# Altium schematic sheet Power.SchDoc
size A3; SheetNumber: 2; SheetTotal: 4
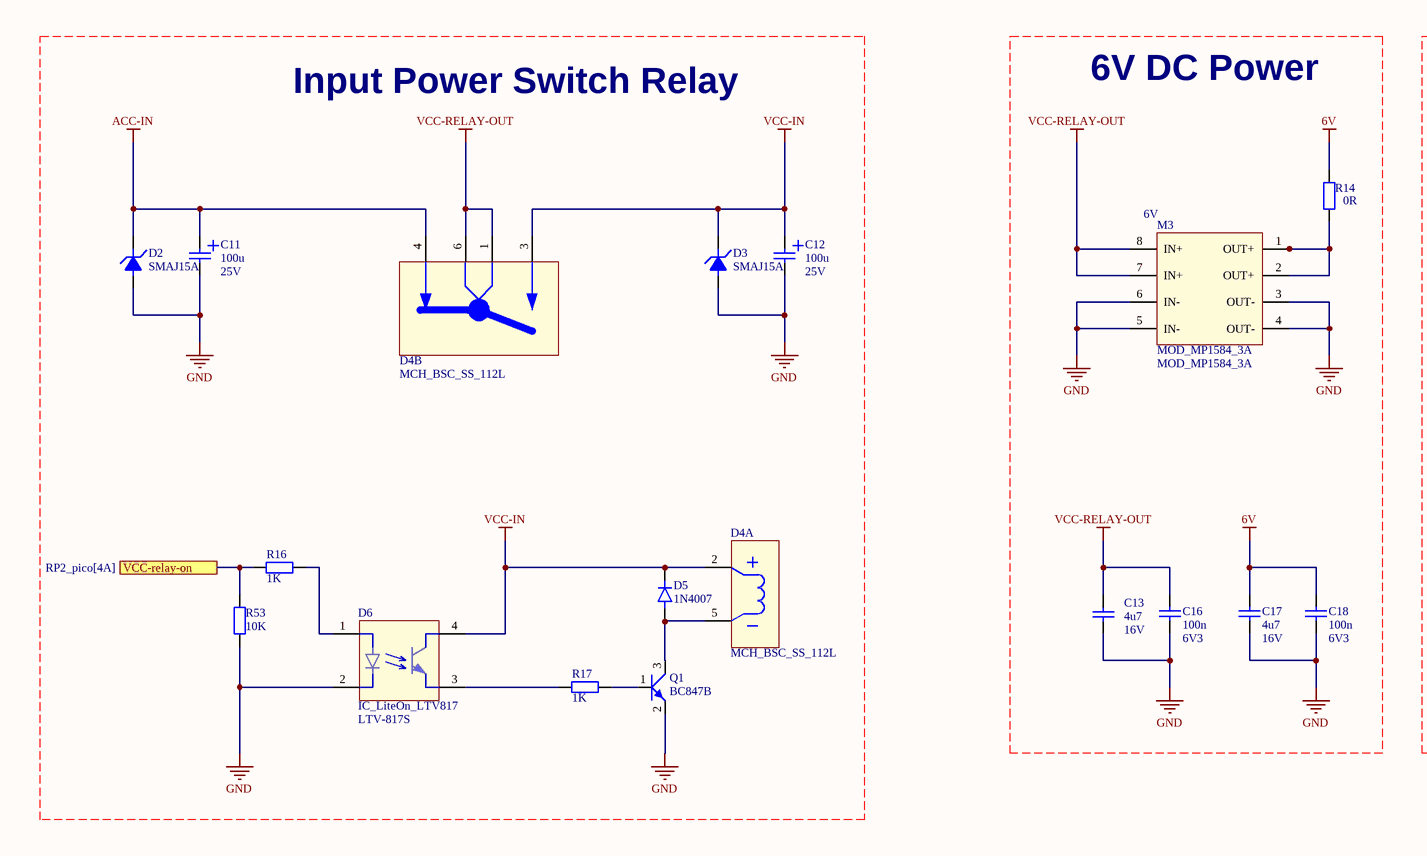
[diagram p0: Power.SchDoc, left]
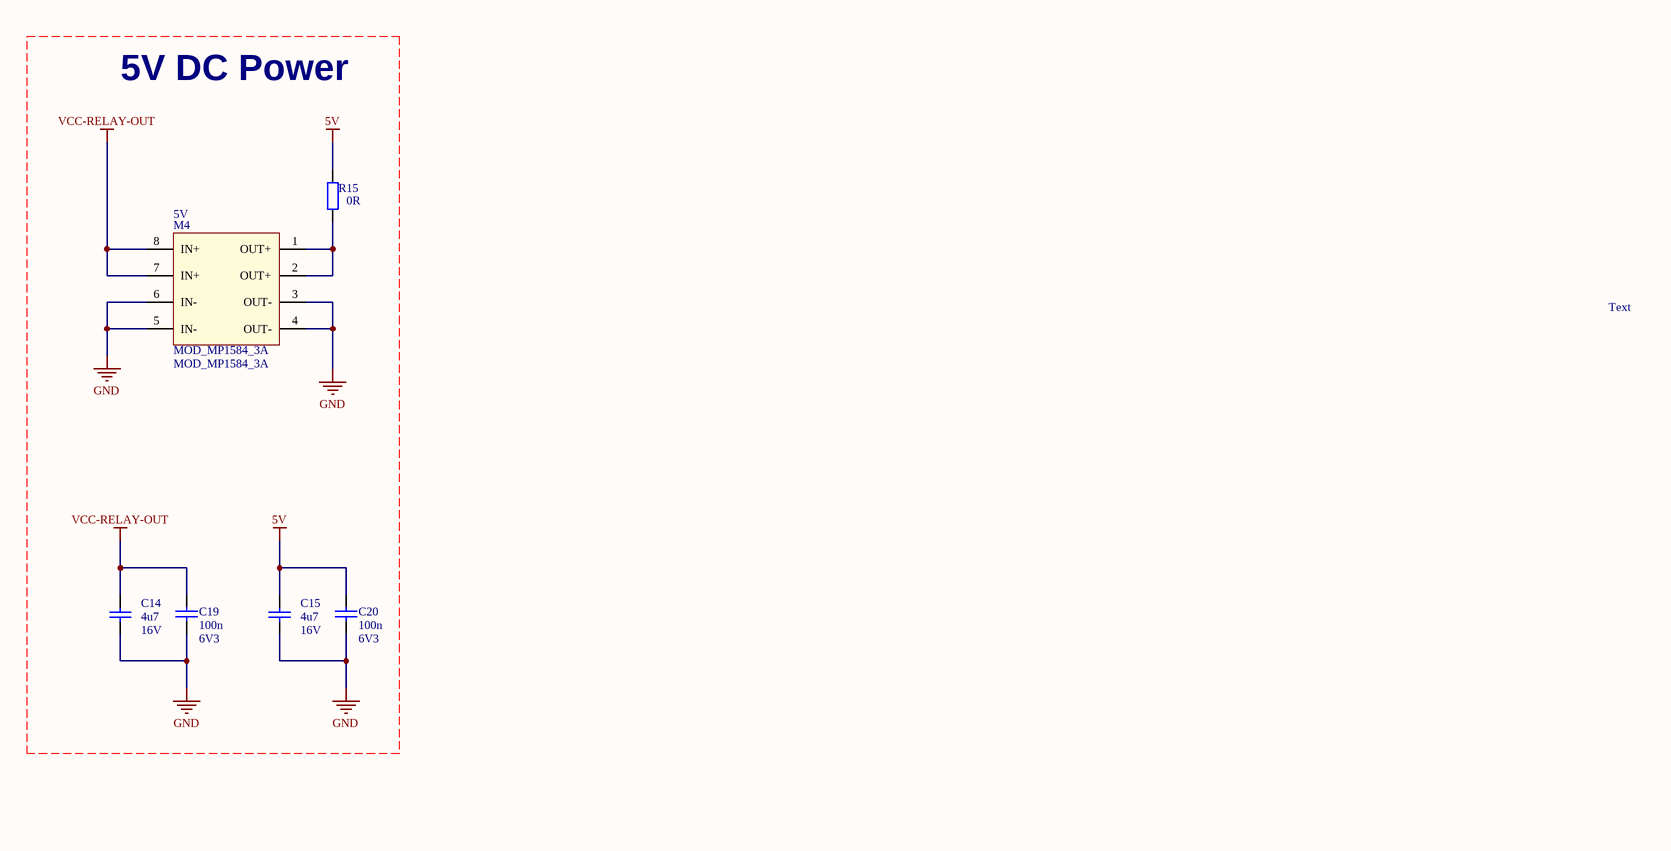
[diagram p1: Power.SchDoc, right]

## Parts
C11  Value1: 100u  Value2: 25V  [CAPAE9983X102N]  (hidden comment: CAP_POL)
C12  Value1: 100u  Value2: 25V  [CAPAE9983X102N]  (hidden comment: CAP_POL)
C13  Value1: 4u7  Value2: 16V  [CAPC2012X140N]  (hidden comment: CAP)
C14  Value1: 4u7  Value2: 16V  [CAPC2012X140N]  (hidden comment: CAP)
C15  Value1: 4u7  Value2: 16V  [CAPC2012X140N]  (hidden comment: CAP)
C16  Value1: 100n  Value2: 6V3  [CAPC2012X88N]  (hidden comment: CAP)
C17  Value1: 4u7  Value2: 16V  [CAPC2012X140N]  (hidden comment: CAP)
C18  Value1: 100n  Value2: 6V3  [CAPC2012X88N]  (hidden comment: CAP)
C19  Value1: 100n  Value2: 6V3  [CAPC2012X88N]  (hidden comment: CAP)
C20  Value1: 100n  Value2: 6V3  [CAPC2012X88N]  (hidden comment: CAP)
D2  Value1: SMAJ15A  [DO-214AC]  (hidden comment: DIO_UNIDIRECTIONAL_TVS)
D3  Value1: SMAJ15A  [DO-214AC]  (hidden comment: DIO_UNIDIRECTIONAL_TVS)
D4  MCH_BSC_SS_112L  [MCH_BSC_SS_112L]  (parts A,B of 2)
D5  Value1: 1N4007  [DO-214AC]  (hidden comment: DIO)
D6  IC_LiteOn_LTV817  Value1: LTV-817S  [IC_LiteOn_ LTV-817S]
M3  MOD_MP1584_3A  [MOD_MP1584_3A]
M4  MOD_MP1584_3A  [MOD_MP1584_3A]
Q1  Value1: BC847B  [SOT23]  (hidden comment: TRS_NPN_123)
R14  Value1: 0R  [RESC2012X60N]  (hidden comment: RES)
R15  Value1: 0R  [RESC2012X60N]  (hidden comment: RES)
R16  Value1: 1K  [RESC2012X60N]  (hidden comment: RES)
R17  Value1: 1K  [RESC2012X60N]  (hidden comment: RES)
R53  Value1: 10K  [RESC2012X60N]  (hidden comment: RES)

## Ports
VCC-relay-on (see RP2_pico[4A])

## Nets
5V: C15.1 C20.2 R15.2
6V: C17.2 C18.2 R14.2
ACC-IN: C11.1 D2.2 D4.4
GND: C11.2 C12.2 C13.2 C14.2 C15.2 C16.1 C17.1 C18.1 C19.1 C20.1 D2.1 D3.1 D6.2 M3.3(OUT-) M3.4(OUT-) M3.5(IN-) M3.6(IN-) M4.3(OUT-) M4.4(OUT-) M4.5(IN-) M4.6(IN-) Q1.2(E) R53.2
VCC-IN: C12.1 D3.2 D4.2 D4.3 D5.2(K) D6.4
VCC-RELAY-OUT: C13.1 C14.1 C16.2 C19.2 D4.1 D4.6 M3.7(IN+) M3.8(IN+) M4.7(IN+) M4.8(IN+)
VCC-relay-on: R16.2 R53.1 ; port VCC-relay-on
NetD4_5: D4.5 D5.1(A) Q1.3(C)
NetD6_1: D6.1 R16.1
NetD6_3: D6.3 R17.2
NetM3_1: M3.1(OUT+) M3.2(OUT+) R14.1
NetM4_1: M4.1(OUT+) M4.2(OUT+) R15.1
NetQ1_1: Q1.1(B) R17.1

## Notes on the sheet
- Input Power Switch Relay
- 6V DC Power
- 5V DC Power
- (near M3) 6V
- (near M4) 5V
- Text

## Library data of the parts
C11 C12 = 01_01471: PANASONIC - EEEFC1E101AP - CAP, ALU ELEC, 100UF, 25V, SMD, REEL; AutoId: 1471; DeviceType: capacitor; SubType: Electrolyte; Id: 01_01471; Manufacturer: Panasonic; Manufacturer PN: EEEFC1E101AP; Status: 0 - Unchecked; MountType: SMD; ComponentLink1URL: X:\01_dataSheets\CAP_PANASONIC_EEUFCXXXXXX.pdf; Supplier 1: Farnell; Supplier Part Number 1: 2254349; ComponentLink1Description: Datasheet
C13-C15 C17 = 01_01402: X7R 10% 0805; Manufacturer: MURATA; Manufacturer PN: GRM21BR71C475KA73L; AutoId: 1402; DeviceType: capacitor; SubType: Ceramic; Id: 01_01402; Status: 2 - Checked and Approved; MountType: SMD; ComponentLink1URL: X:\01_DataSheets\CAP_MURATA_GRM.pdf; Supplier 1: Farnell; Supplier Part Number 1: 1797015; ComponentLink1Description: Datasheet
C16 C18-C20 = 01_00637: X7R 10% 0805; Manufacturer: KEMET; Manufacturer PN: C0805C104K9RACTU; AutoId: 637; DeviceType: capacitor; SubType: Ceramic; Id: 01_00637; Status: 2 - Checked and Approved; MountType: SMT; ComponentLink1URL: X:\01_Datasheets\CAP_KEMET_CxxxxCxxxXxRAC.pdf; Supplier 1: Farnell; Supplier Part Number 1: 80-C0805C104K9R; ComponentLink1Description: Datasheet
D2 D3 = 03_00100: Transient Voltage Suppressors; Manufacturer: Littelfuse; AutoId: 118; Value2: 15Vr 400W 16.4A; Value3: TVS; DeviceType: diode; Id: 03_00100; Manufacturer PN: SMAJ15A; Status: 0 - Unchecked; MountType: SMD; ComponentLink1Description: Datasheet; ComponentLink1URL: X:\01_Datasheets\DIO_Littelfuse_SMAJ58A.pdf; ComponentLink2Description: ComponentVerificationSheet; ComponentLink2URL: X:\02_ComponentVerificationSheets\; Supplier Part Number 1: SMAJ15A
D4 = 09_0010: Small relay 6 pins 12V, 2A; Manufacturer: KJS; AutoId: 10; Id: 09_0010; Value1: n/a; Value2: n/a; ComponentLink1Description: Datasheet; ComponentLink1URL: X:\01_Datasheets\MCH_BSC_SS_112L.pdf; ComponentLink2Description: ComponentVerificationSheet; ComponentLink2URL: X:\02_ComponentVerificationSheets\
D5 = 03_00099: M7 Diode, max 30A; AutoId: 117; Value2: 1A, 400V; Id: 03_00099; Value3: M7; Manufacturer PN: 1N4007; DeviceType: diode; ComponentLink1Description: Datasheet; ComponentLink1URL: X:\01_Datasheets\; ComponentLink2Description: ComponentVerificationSheet; ComponentLink2URL: X:\02_ComponentVerificationSheets\
D6 = 07_00275: Transistor Output Optocouplers Optocoupler Phototrans; Manufacturer: Lite-On; AutoId: 276; Id: 07_00275; Value2: Optocouplers; Value3: Optocouplers; Manufacturer PN: LTV-817S; DeviceType: Optocouple; Status: 0 - Unchecked; MountType: SMT; ComponentLink1Description: Datasheet; ComponentLink1URL: X:\01_Datasheets\IC_Lite_On_LTV-817S.pdf; ComponentLink2Description: ComponentVerificationSheet; ComponentLink2URL: X:\02_ComponentVerificationSheets\; Supplier 1: Mouser; Supplier Part Number 1: 859-LTV-817S
M3 M4 = 12_00162: DC-DC converter 3A; Manufacturer: CH; AutoId: 173; Value2: Module; DeviceType: misc; Id: 12_00162; Value1: MOD_MP1584_3A; Status: 0 - Unchecked; MountType: THD; ComponentLink1Description: Datasheet; ComponentLink1URL: X:\01_Datasheets\; ComponentLink2Description: ComponentVerificationSheet; ComponentLink2URL: X:\02_ComponentVerificationSheets\; Supplier 1: Arduino.ua
Q1 = 19_00039: Bipolar Transistors - BJT NPN 45V 100mA; Manufacturer: NXP; Manufacturer PN: BC847B,215; AutoId: 39; Value2: 45V 0,1A; Id: 19_00039; DeviceType: transistor; SubType: NPN; Status: 0 - Unchecked; MountType: SMD; ComponentLink1Description: Datasheet; ComponentLink1URL: X:\01_Datasheets\TRS_NXP_BC847.pdf; ComponentLink2Description: ComponentVerificationSheet; ComponentLink2URL: X:\02_ComponentVerificationSheets\; Supplier 1: Mouser; Supplier Part Number 1: 771-BC847B-T/R
R14 R15 = 15_00632: Thick Film Resistors - SMD ZERO OHM JUMPER 1/8watt; Manufacturer: Vishay; Manufacturer PN: RCG08050000Z0EA`; AutoId: 632; Value2: 125mW; Id: 15_00632; Footprint4: n/a; DeviceType: resistor; Status: 0 - Unchecked; MountType: SMT; ComponentLink1Description: Datasheet; ComponentLink1URL: X:\01_Datasheets\; Supplier 1: Mouser; Supplier Part Number 1: 71-RCG08050000Z0EA
R16 R17 = 15_00329: RESISTOR, 0805, 1K, 1%, SMD; Manufacturer: Yageo; Manufacturer PN: RC0805FR-071K; AutoId: 329; Value2: 0W125; SubType: Metal film; Id: 15_00329; DeviceType: resistor; Status: 2 - Checked and Approved; MountType: SMT; ComponentLink1Description: Datasheet; ComponentLink1URL: X:\01_Datasheets\RES_YAGEO_RC0805FR.pdf; Supplier 1: Farnell; Supplier Part Number 1: 9237496
R53 = 15_00341: RESISTOR, 0805, 10K, 1%, SMD; Manufacturer: Yageo; Manufacturer PN: RC0805FR-0710K; AutoId: 341; Value2: 0W125; SubType: Metal film; Id: 15_00341; DeviceType: resistor; Status: 0 - Unchecked; MountType: SMT; ComponentLink1Description: Datasheet; ComponentLink1URL: X:\01_Datasheets\RES_YAGEO_RC0805FR.pdf; Supplier 1: Farnell